# Altium schematic sheet Power.SchDoc
size A4
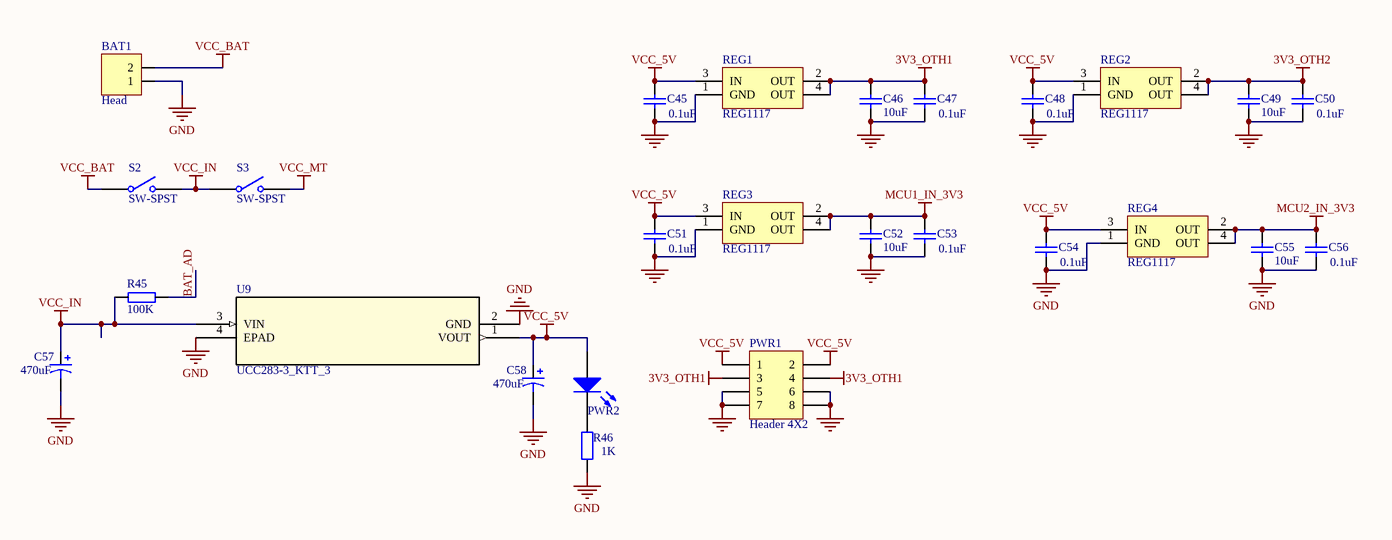
[diagram p0: Power.SchDoc]

## Parts
BAT1  Head  [Head_Small]
C45  value 0.1uF  [0805]  (hidden comment: Cap Semi)
C46  value 10uF  [0805]  (hidden comment: 0.1uf)
C47  value 0.1uF  [0805]  (hidden comment: Cap Semi)
C48  value 0.1uF  [0805]  (hidden comment: Cap Semi)
C49  value 10uF  [0805]  (hidden comment: 0.1uf)
C50  value 0.1uF  [0805]  (hidden comment: Cap Semi)
C51  value 0.1uF  [0805]  (hidden comment: Cap Semi)
C52  value 10uF  [0805]  (hidden comment: 0.1uf)
C53  value 0.1uF  [0805]  (hidden comment: Cap Semi)
C54  value 0.1uF  [0805]  (hidden comment: Cap Semi)
C55  value 10uF  [0805]  (hidden comment: 0.1uf)
C56  value 0.1uF  [0805]  (hidden comment: Cap Semi)
C57  470uF  [SMD-EC-F8]
C58  470uF  [SMD-EC-F8]
PWR1  Header 4X2  [HDR2X4]
PWR2  LED  [0805]  (value not drawn)
R45  100K  [0805]
R46  value 1K  [0805]  (hidden comment: Res2)
REG1  REG1117  [SOT-223]
REG2  REG1117  [SOT-223]
REG3  REG1117  [SOT-223]
REG4  REG1117  [SOT-223]
S2  SW-SPST  [Switch_N]
S3  SW-SPST  [Switch_N]
U9  UCC283-3_KTT_3  [KTT3_6P22X6P6]

## Nets
3V3_OTH1: C46.2 C47.2 PWR1.3 PWR1.4 REG1.2(OUT) REG1.4(OUT)
3V3_OTH2: C49.2 C50.2 REG2.2(OUT) REG2.4(OUT)
GND: BAT1.1 C45.1 C46.1 C47.1 C48.1 C49.1 C50.1 C51.1 C52.1 C53.1 C54.1 C55.1 C56.1 C57.2 C58.2 PWR1.5 PWR1.6 PWR1.7 PWR1.8 R46.1 REG1.1(GND) REG2.1(GND) REG3.1(GND) REG4.1(GND) U9.2(GND) U9.4(EPAD)
MCU1_IN_3V3: C52.2 C53.2 REG3.2(OUT) REG3.4(OUT)
MCU2_IN_3V3: C55.2 C56.2 REG4.2(OUT) REG4.4(OUT)
VCC_5V: C45.2 C48.2 C51.2 C54.2 C58.1 PWR1.1 PWR1.2 PWR2.1(A) REG1.3(IN) REG2.3(IN) REG3.3(IN) REG4.3(IN) U9.1(VOUT)
VCC_BAT: BAT1.2 S2.1(COMMON)
VCC_IN: C57.1 R45.1 S2.2(NO) S3.1(COMMON) U9.3(VIN)
VCC_MT: S3.2(NO)
BAT_AD: R45.2
NetPWR2_2: PWR2.2(K) R46.2

## Library data of the parts
BAT1 = Head_My
C45 C47 C48 C50 C51 C53 C54 C56 = Cap Semi: Capacitor (Semiconductor SIM Model); Published: 8-Jun-2000; Revision: July-2002: Re-released for DXP Platform.; Publisher: Altium Limited
C46 C49 C52 C55 = CAP1
C57 C58 = Cap Pol1: Polarized Capacitor (Radial); Published: 8-Jun-2000; LatestRevisionDate: 17-Jul-2002; LatestRevisionNote: Re-released for DXP Platform.; PackageReference: RB7.6-15; Publisher: Altium Limited; PackageDescription: Polarized Capacitor (Radial); 2 Leads
PWR1 = Header 4X2: Header, 4-Pin, Dual row; LatestRevisionDate: 17-Jul-2002; LatestRevisionNote: Re-released for DXP Platform.; Publisher: Altium Limited
R45 = R
R46 = Res2: Resistor; Published: 8-Jun-2000; LatestRevisionDate: 17-Jul-2002; LatestRevisionNote: Re-released for DXP Platform.; PackageReference: AXIAL-0.4; Publisher: Altium Limited
S2 S3 = SW-SPST: Single-Pole, Single-Throw Switch; Published: 24-Mar-1999; LatestRevisionDate: 17-Jul-2002; LatestRevisionNote: Re-released for DXP Platform.; PackageReference: SPST-2; Publisher: Altium Limited; PackageDescription: Switch; 2 Leads
U9 = UCC283-3_KTT_3: Imported; Vendor: Texas Instruments; PACKAGE_DESIGNATOR: KTT; PIN_COUNT: 3; FAMILY_NAME: SINGLE CHANNEL LDO; INDUSTRY_STD_PKG_TYPE: DDPAK/TO-263; Manufacturer_Part_Number: ucc283-3_ktt_3; GENERIC_PART_NUMBER: UCC283-3; Manufacturer: Texas Instruments; Datasheet_URL: http://www.ti.com/lit/gpn/UCC283-3; Value: Value; Type: Type; RefDes: RefDes